# Altium schematic sheet FiltrosRF_R00.SchDoc
size A4; SheetNumber: 1; SheetTotal: 1
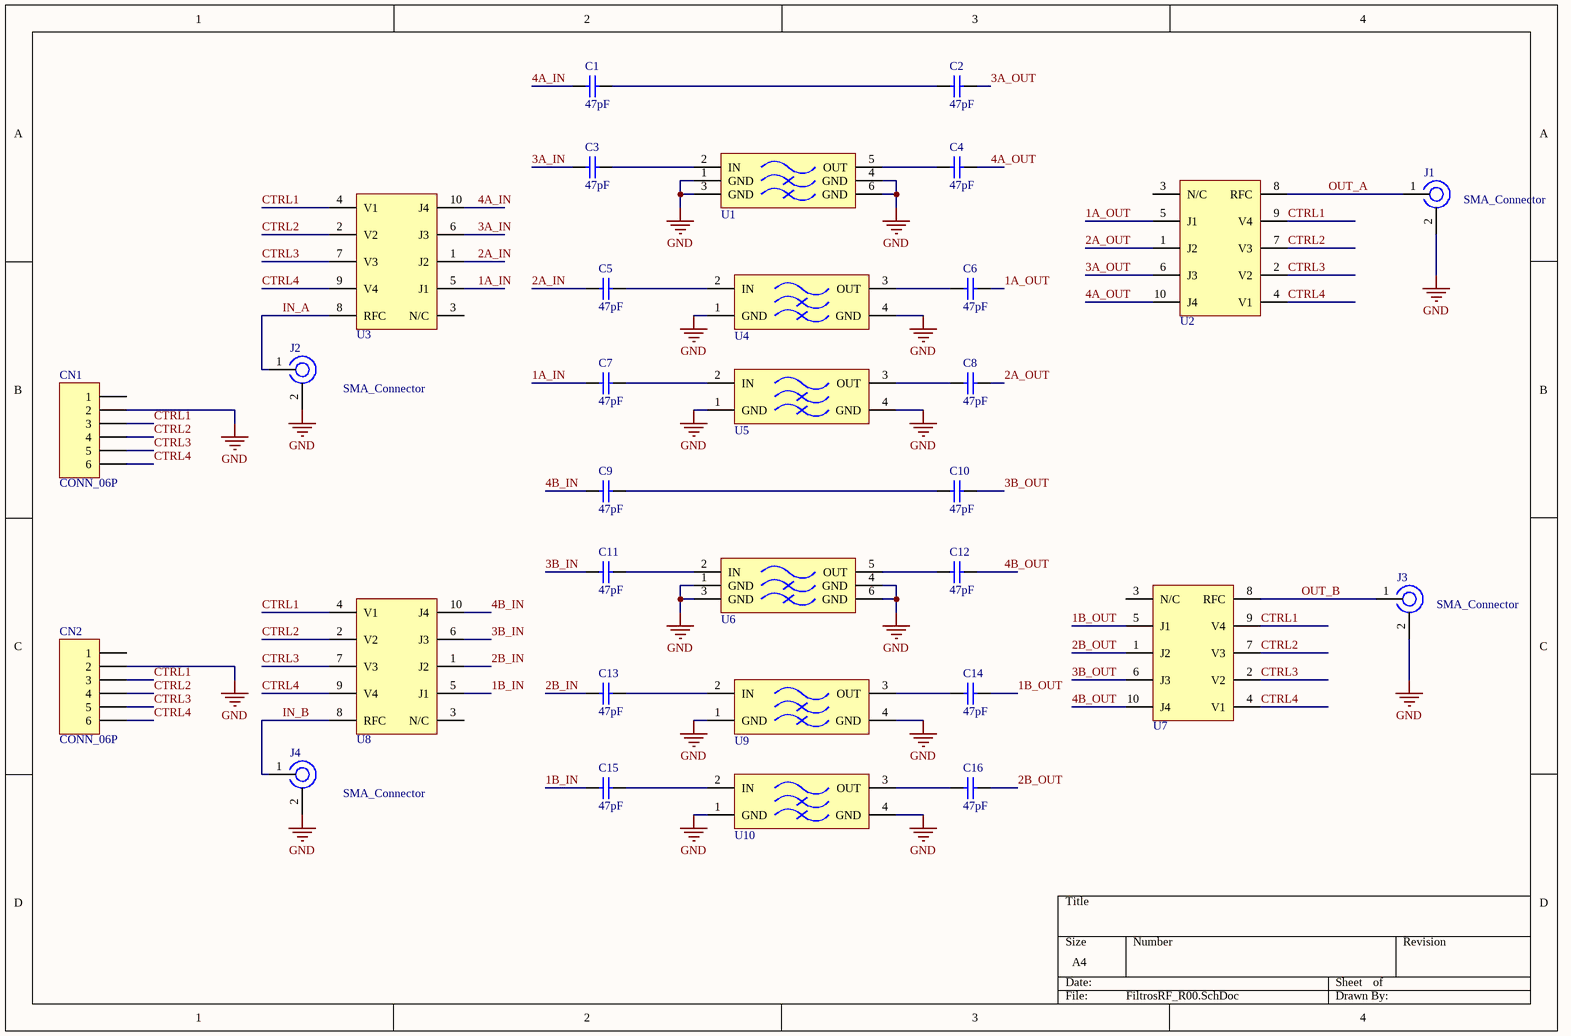
[diagram p0: FiltrosRF_R00.SchDoc]

## Parts
C1  value 47pF  [C_0603]  (hidden comment: Capacitor)
C2  value 47pF  [C_0603]  (hidden comment: Capacitor)
C3  value 47pF  [C_0603]  (hidden comment: Capacitor)
C4  value 47pF  [C_0603]  (hidden comment: Capacitor)
C5  value 47pF  [C_0603]  (hidden comment: Capacitor)
C6  value 47pF  [C_0603]  (hidden comment: Capacitor)
C7  value 47pF  [C_0603]  (hidden comment: Capacitor)
C8  value 47pF  [C_0603]  (hidden comment: Capacitor)
C9  value 47pF  [C_0603]  (hidden comment: Capacitor)
C10  value 47pF  [C_0603]  (hidden comment: Capacitor)
C11  value 47pF  [C_0603]  (hidden comment: Capacitor)
C12  value 47pF  [C_0603]  (hidden comment: Capacitor)
C13  value 47pF  [C_0603]  (hidden comment: Capacitor)
C14  value 47pF  [C_0603]  (hidden comment: Capacitor)
C15  value 47pF  [C_0603]  (hidden comment: Capacitor)
C16  value 47pF  [C_0603]  (hidden comment: Capacitor)
CN1  CONN_06P  [Header_M_1x6_0.1"]
CN2  CONN_06P  [Header_M_1x6_0.1"]
J1  SMA_Connector  [SMA_Connector]
J2  SMA_Connector  [SMA_Connector]
J3  SMA_Connector  [SMA_Connector]
J4  SMA_Connector  [SMA_Connector]
U1  3550LP14A0300001T  [Low Pass Filter 0603 6 Pins]  (value not drawn)
U2  SKY13322-375LF  (value not drawn)
U3  SKY13322-375LF  (value not drawn)
U4  LP0603A-XXXX-ANTR  [Low Pass Filter 0603 4 Pins]  (value not drawn)
U5  LP0603A-XXXX-ANTR  [Low Pass Filter 0603 4 Pins]  (value not drawn)
U6  3550LP14A0300001T  [Low Pass Filter 0603 6 Pins]  (value not drawn)
U7  SKY13322-375LF  (value not drawn)
U8  SKY13322-375LF  (value not drawn)
U9  LP0603A-XXXX-ANTR  [Low Pass Filter 0603 4 Pins]  (value not drawn)
U10  LP0603A-XXXX-ANTR  [Low Pass Filter 0603 4 Pins]  (value not drawn)

## Nets
GND: CN1.2 CN2.2 J1.2 J2.2 J3.2 J4.2 U1.1(GND) U1.3(GND) U1.4(GND) U1.6(GND) U4.1(GND) U4.4(GND) U5.1(GND) U5.4(GND) U6.1(GND) U6.3(GND) U6.4(GND) U6.6(GND) U9.1(GND) U9.4(GND) U10.1(GND) U10.4(GND)
1A_IN: C7.1 U3.5(J1)
1A_OUT: C6.2 U2.5(J1)
1B_IN: C15.1 U8.5(J1)
1B_OUT: C14.2 U7.5(J1)
2A_IN: C5.1 U3.1(J2)
2A_OUT: C8.2 U2.1(J2)
2B_IN: C13.1 U8.1(J2)
2B_OUT: C16.2 U7.1(J2)
3A_IN: C3.1 U3.6(J3)
3A_OUT: C2.2 U2.6(J3)
3B_IN: C11.1 U8.6(J3)
3B_OUT: C10.2 U7.6(J3)
4A_IN: C1.1 U3.10(J4)
4A_OUT: C4.2 U2.10(J4)
4B_IN: C9.1 U8.10(J4)
4B_OUT: C12.2 U7.10(J4)
CTRL1: CN1.3 CN2.3 U2.9(V4) U3.4(V1) U7.9(V4) U8.4(V1)
CTRL2: CN1.4 CN2.4 U2.7(V3) U3.2(V2) U7.7(V3) U8.2(V2)
CTRL3: CN1.5 CN2.5 U2.2(V2) U3.7(V3) U7.2(V2) U8.7(V3)
CTRL4: CN1.6 CN2.6 U2.4(V1) U3.9(V4) U7.4(V1) U8.9(V4)
IN_A: J2.1 U3.8(RFC)
IN_B: J4.1 U8.8(RFC)
OUT_A: J1.1 U2.8(RFC)
OUT_B: J3.1 U7.8(RFC)
NetC1_2: C1.2 C2.1
NetC3_2: C3.2 U1.2(IN)
NetC4_1: C4.1 U1.5(OUT)
NetC5_2: C5.2 U4.2(IN)
NetC6_1: C6.1 U4.3(OUT)
NetC7_2: C7.2 U5.2(IN)
NetC8_1: C8.1 U5.3(OUT)
NetC9_2: C9.2 C10.1
NetC11_2: C11.2 U6.2(IN)
NetC12_1: C12.1 U6.5(OUT)
NetC13_2: C13.2 U9.2(IN)
NetC14_1: C14.1 U9.3(OUT)
NetC15_2: C15.2 U10.2(IN)
NetC16_1: C16.1 U10.3(OUT)

Not connected (* = marked no-connect by the designer): CN1 1; CN2 1; U2 3(N/C); U3 3(N/C); U7 3(N/C); U8 3(N/C)

## Library data of the parts
C1-C16 = Capacitor: SimulationGenericComponent: True
CN1 CN2 = CONN_06P: Connector Generic 4 Vias
J1-J4 = SMA_Connector: Connector SMA
U1 U6 = 3550LP14A0300001T: RF FILTER LOW PASS  0603
U2 U3 U7 U8 = SKY13322-375LF: RF Switch IC General Purpose SP4T 6 GHz 50Ohm 10-MLPD (3x2)
U4 U5 U9 U10 = LP0603A-XXXX-ANTR: RF FILTER 0603